# EAGLE design ATEM 2x8GPIOv1.1 (EAGLE 6.2)
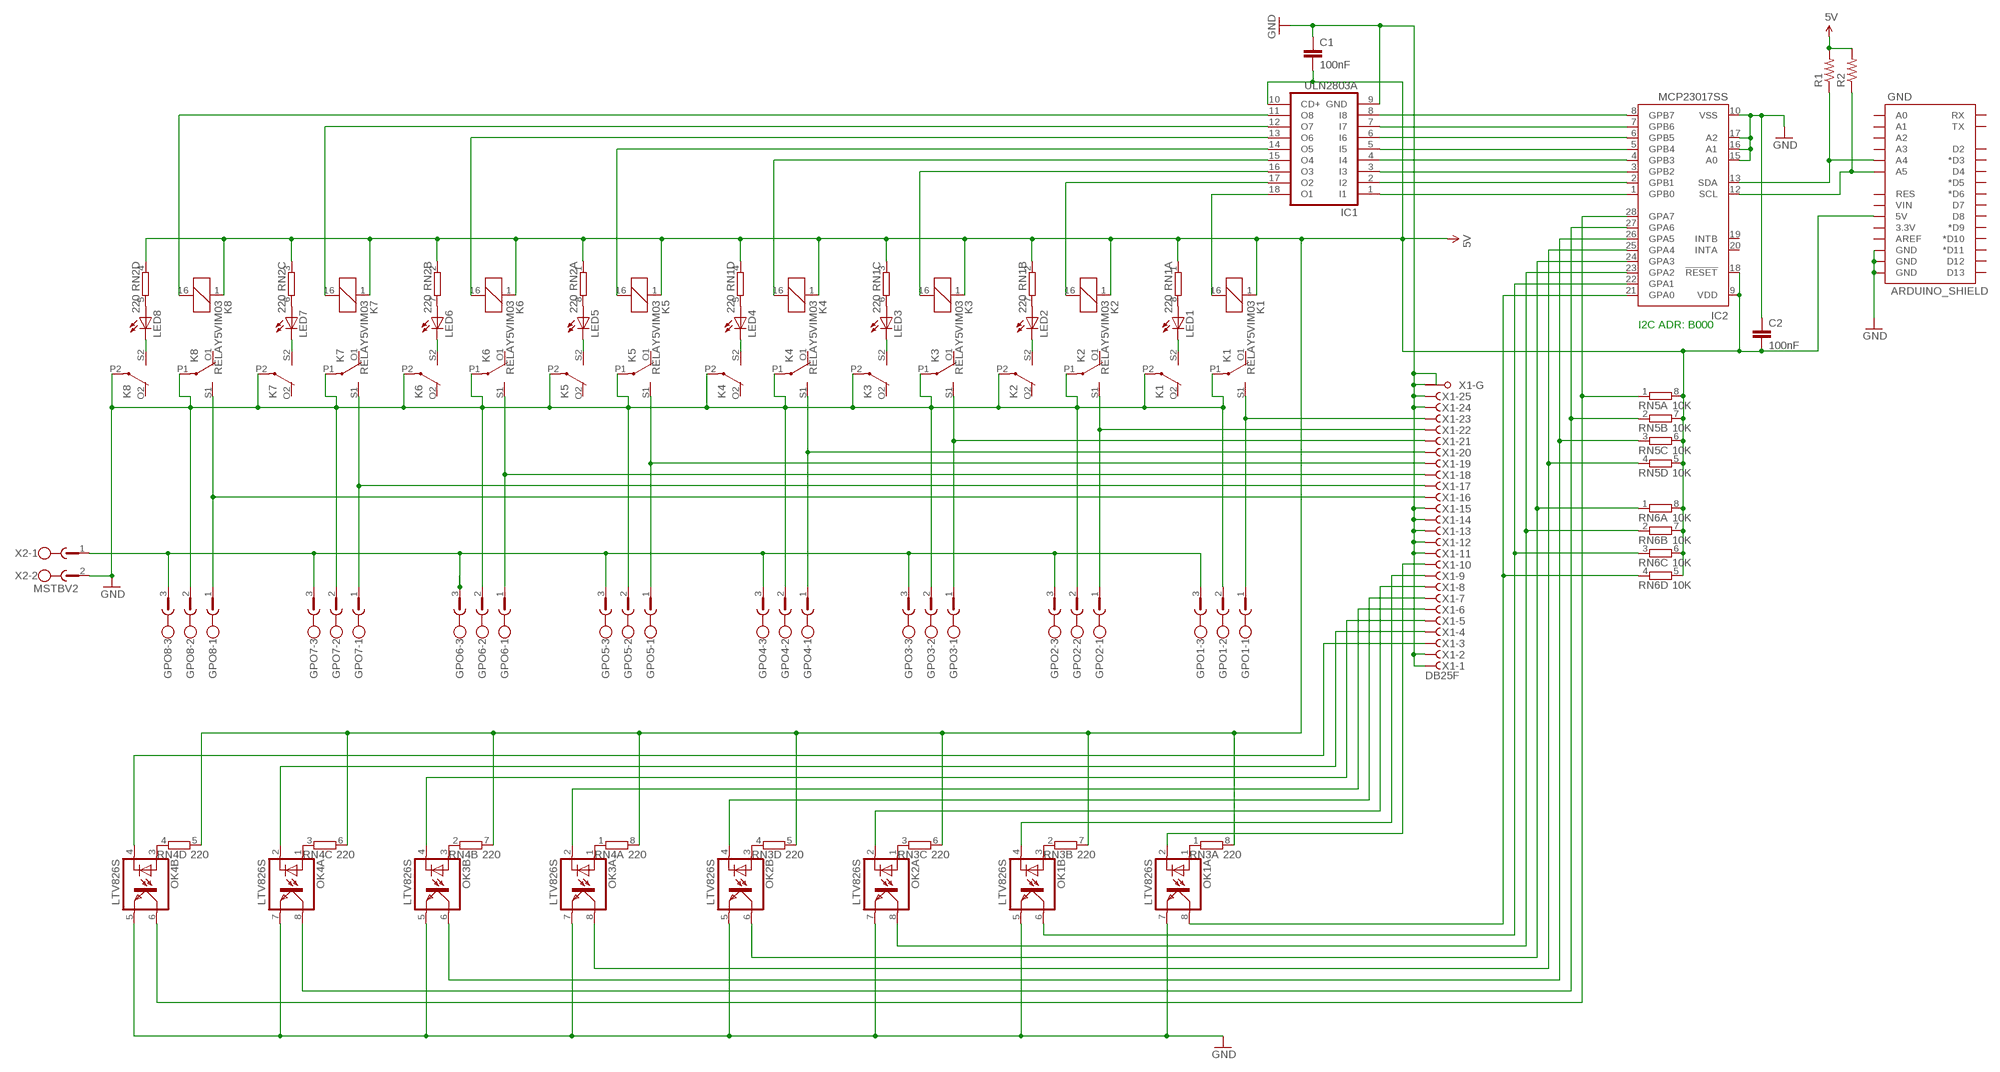
[diagram p0: schematic, sheet 1]

## Parts
C1  100nF  CAP0805  [0805]
C2  100nF  CAP0603-CAP  [0603-CAP]
GND  ARDUINO_SHIELD  [ARDUINO_BOXSHIELD_NOHOLES]
GPO1  CON1  MSTBV3  [MSTBV3]
GPO2  CON1  MSTBV3  [MSTBV3]
GPO3  CON1  MSTBV3  [MSTBV3]
GPO4  CON1  MSTBV3  [MSTBV3]
GPO5  CON1  MSTBV3  [MSTBV3]
GPO6  CON1  MSTBV3  [MSTBV3]
GPO7  CON1  MSTBV3  [MSTBV3]
GPO8  GPO8  MSTBV3  [MSTBV3]
IC1  ULN2803A  ULN2803ASO18W  [SO18W]
IC2  MCP23017SS  [SSOP28]
K1  RELAY5VIM03  [DS2Y]
K2  RELAY5VIM03  [DS2Y]
K3  RELAY5VIM03  [DS2Y]
K4  RELAY5VIM03  [DS2Y]
K5  RELAY5VIM03  [DS2Y]
K6  RELAY5VIM03  [DS2Y]
K7  RELAY5VIM03  [DS2Y]
K8  RELAY5VIM03  [DS2Y]
LED1  LED0603  [LED-0603]
LED2  LED0603  [LED-0603]
LED3  LED0603  [LED-0603]
LED4  LED0603  [LED-0603]
LED5  LED0603  [LED-0603]
LED6  LED0603  [LED-0603]
LED7  LED0603  [LED-0603]
LED8  LED0603  [LED-0603]
OK1  LTV826S  [DIL8-SMD]
OK2  LTV826S  [DIL8-SMD]
OK3  LTV826S  [DIL8-SMD]
OK4  LTV826S  [DIL8-SMD]
R1  RESISTOR0603-RES  [0603-RES]
R2  RESISTOR0603-RES  [0603-RES]
RN1  220  4R-NCAY16  [CAY16]
RN2  220  4R-NCAY16  [CAY16]
RN3  220  4R-NCAY16  [CAY16]
RN4  220  4R-NCAY16  [CAY16]
RN5  10K  4R-NCAY16  [CAY16]
RN6  10K  4R-NCAY16  [CAY16]
X1  DB25F  F25HPS  [F25HP]
X2  MSTBV2  [MSTBV2]

## Nets
5V [PWR]: C1.2 C2.2 GND.5V@0(5V) IC1.10(CD+) IC2.9(VDD) IC2.18(!RESET) K1.1 K2.1 K3.1 K4.1 K5.1 K6.1 K7.1 K8.1 R1.2 R2.2 RN1.1 RN1.2 RN1.3 RN1.4 RN2.1 RN2.2 RN2.3 RN2.4 RN3.5 RN3.6 RN3.7 RN3.8 RN4.5 RN4.6 RN4.7 RN4.8 RN5.5 RN5.6 RN5.7 RN5.8 RN6.5 RN6.6 RN6.7 RN6.8
GND [PWR]: C1.1 C2.1 GND.GND@0(GND) GND.GND@1(GND) GND.GND@4(GND) GPO1.2 GPO2.2 GPO3.2 GPO4.2 GPO5.2 GPO6.2 GPO7.2 GPO8.2 IC1.9(GND) IC2.10(VSS) IC2.15(A0) IC2.16(A1) IC2.17(A2) K1.P1(2:P) K1.P2(3:P) K2.P1(2:P) K2.P2(3:P) K3.P1(2:P) K3.P2(3:P) K4.P1(2:P) K4.P2(3:P) K5.P1(2:P) K5.P2(3:P) K6.P1(2:P) K6.P2(3:P) K7.P1(2:P) K7.P2(3:P) K8.P1(2:P) K8.P2(3:P) OK1.5(B:EMIT) OK1.7(A:EMIT) OK2.5(B:EMIT) OK2.7(A:EMIT) OK3.5(B:EMIT) OK3.7(A:EMIT) OK4.5(B:EMIT) OK4.7(A:EMIT) X1.1(-1:F) X1.2(-2:F) X1.11(-11:F) X1.12(-12:F) X1.13(-13:F) X1.14(-14:F) X1.15(-15:F) X1.24(-24:F) X1.25(-25:F) X1.G1(-G:G1) X1.G2(-G:G2) X2.2
N$1 [RELAY LINES]: GPO1.1 K1.S1(2:S) X1.23(-23:F)
N$3: K1.S2(3:S) LED1.C
N$4: IC1.18(O1) K1.16
N$5: IC1.1(I1) IC2.1(GPB0)
N$6 [RELAY LINES]: GPO2.1 K2.S1(2:S) X1.22(-22:F)
N$8: K2.S2(3:S) LED2.C
N$9: IC1.17(O2) K2.16
N$10 [RELAY LINES]: GPO3.1 K3.S1(2:S) X1.21(-21:F)
N$12: K3.S2(3:S) LED3.C
N$13: IC1.16(O3) K3.16
N$14 [RELAY LINES]: GPO4.1 K4.S1(2:S) X1.20(-20:F)
N$16: K4.S2(3:S) LED4.C
N$17: IC1.15(O4) K4.16
N$18 [RELAY LINES]: GPO5.1 K5.S1(2:S) X1.19(-19:F)
N$20: K5.S2(3:S) LED5.C
N$21: IC1.14(O5) K5.16
N$22 [RELAY LINES]: GPO6.1 K6.S1(2:S) X1.18(-18:F)
N$24: K6.S2(3:S) LED6.C
N$25: IC1.13(O6) K6.16
N$26 [RELAY LINES]: GPO7.1 K7.S1(2:S) X1.17(-17:F)
N$28: K7.S2(3:S) LED7.C
N$29: IC1.12(O7) K7.16
N$30 [RELAY LINES]: GPO8.1 K8.S1(2:S) X1.16(-16:F)
N$32: K8.S2(3:S) LED8.C
N$33: IC1.11(O8) K8.16
N$34: IC1.2(I2) IC2.2(GPB1)
N$35: IC1.3(I3) IC2.3(GPB2)
N$36: IC1.4(I4) IC2.4(GPB3)
N$37: IC1.5(I5) IC2.5(GPB4)
N$38: IC1.6(I6) IC2.6(GPB5)
N$39: IC1.7(I7) IC2.7(GPB6)
N$40: IC1.8(I8) IC2.8(GPB7)
N$41: LED1.A RN1.8
N$42: LED2.A RN1.7
N$43: LED3.A RN1.6
N$44: LED4.A RN1.5
N$45: LED5.A RN2.8
N$46: LED6.A RN2.7
N$47: LED7.A RN2.6
N$48: LED8.A RN2.5
N$49 [INput lines]: OK1.2(A:C) X1.10(-10:F)
N$50: OK1.1(A:A) RN3.1
N$51: IC2.21(GPA0) OK1.8(A:COL) RN6.4
N$52: OK1.3(B:A) RN3.2
N$53: OK2.1(A:A) RN3.3
N$54: OK2.3(B:A) RN3.4
N$55 [INput lines]: OK3.2(A:C) X1.6(-6:F)
N$56: OK3.1(A:A) RN4.1
N$57: OK3.3(B:A) RN4.2
N$58: OK4.1(A:A) RN4.3
N$59: OK4.3(B:A) RN4.4
N$60 [INput lines]: OK1.4(B:C) X1.9(-9:F)
N$61 [INput lines]: OK2.2(A:C) X1.8(-8:F)
N$62 [INput lines]: OK2.4(B:C) X1.7(-7:F)
N$63: IC2.28(GPA7) OK4.6(B:COL) RN5.1
N$64 [INput lines]: OK3.4(B:C) X1.5(-5:F)
N$65 [INput lines]: OK4.2(A:C) X1.4(-4:F)
N$66 [INput lines]: OK4.4(B:C) X1.3(-3:F)
N$67: GND.A5 IC2.12(SCL) R2.1
N$68: IC2.22(GPA1) OK1.6(B:COL) RN6.3
N$69: IC2.23(GPA2) OK2.8(A:COL) RN6.2
N$70: IC2.24(GPA3) OK2.6(B:COL) RN6.1
N$71: IC2.25(GPA4) OK3.8(A:COL) RN5.4
N$72: IC2.26(GPA5) OK3.6(B:COL) RN5.3
N$73: IC2.27(GPA6) OK4.8(A:COL) RN5.2
N$74: GND.A4 IC2.13(SDA) R1.1
N$75 [RELAY LINES]: GPO1.3 GPO2.3 GPO3.3 GPO4.3 GPO5.3 GPO6.3 GPO7.3 GPO8.3 X2.1
Unconnected: GND.0(RX) GND.1(TX) GND.2(D2) GND.3(*D3) GND.3.3V GND.4(D4) GND.5(*D5) GND.6(*D6) GND.7(D7) GND.8(D8) GND.9(*D9) GND.10(*D10) GND.11(*D11) GND.12(D12) GND.13(D13) GND.A0 GND.A1 GND.A2 GND.A3 GND.AREF GND.RESET(RES) GND.VIN IC2.19(INTB) IC2.20(INTA) K1.O1(2:O) K1.O2(3:O) K2.O1(2:O) K2.O2(3:O) K3.O1(2:O) K3.O2(3:O) K4.O1(2:O) K4.O2(3:O) K5.O1(2:O) K5.O2(3:O) K6.O1(2:O) K6.O2(3:O) K7.O1(2:O) K7.O2(3:O) K8.O1(2:O) K8.O2(3:O)

## Notes on the sheet
- I2C ADR: B000

## Library data of the parts
C1 C2 = SparkFun:CAP: Capacitor Standard 0603 ceramic capacitor, and 0.1" leaded capacitor.
GND = SKAARHOJ:ARDUINO_SHIELD
GPO1-GPO8 = con-phoenix-508:MSTBV3: PHOENIX; MPN: MSTBV 2,5/3-GF-5.08; OC_FARNELL: 1792793; OC_NEWARK: 69R9846
IC1 = uln-udn:ULN2803A: DRIVER ARRAY
IC2 = microchip:MCP23017: http://ww1.microchip.com/downloads/en/DeviceDoc/21952a.pdf Source: http://ww1.microchip.com/downloads/en/DeviceDoc/21952a.pdf; MF: MICROCHIP; MPN: MCP23017-E/SS; OC_FARNELL: 1467674; OC_NEWARK: 31K2960
K1-K8 = SKAARHOJ:RELAY5V: RELAY 2 x switch, AxiCom 150 mW 5V
LED1-LED8 = SparkFun:LED: LEDs Standard schematic elements and footprints for 5mm, 3mm, 1206, and 0603 sized LEDs. 5mm - Spark Fun Electronics SKU : COM-00529 (and others)
OK1-OK4 = optocoupler:LTV826: OPTO COUPLER Source: LITEON, LTV816.pdf; OC_FARNELL: unknown; OC_NEWARK: unknown
R1 R2 = SparkFun:RESISTOR: Resistor Basic schematic elements and footprints for 0603, 1206, and PTH resistors.
RN1-RN6 = resistor-dil:4R-N: Array Chip Resistor Source: RS Component / Phycomp; OC_FARNELL: unknown; OC_NEWARK: unknown
X1 = con-subd:F25HPS: SUB-D; OC_FARNELL: unknown; OC_NEWARK: unknown
X2 = con-phoenix-508:MSTBV2: PHOENIX; MPN: MSTBV 2,5/2-GF-5.08; OC_FARNELL: 1792792; OC_NEWARK: 69R9845

## Net classes
1 PWR: width 0.305 mm, clearance 0.152 mm
2 RELAY LINES: width 0.305 mm, clearance 0.254 mm
3 INput lines: clearance 0.254 mm

## Board
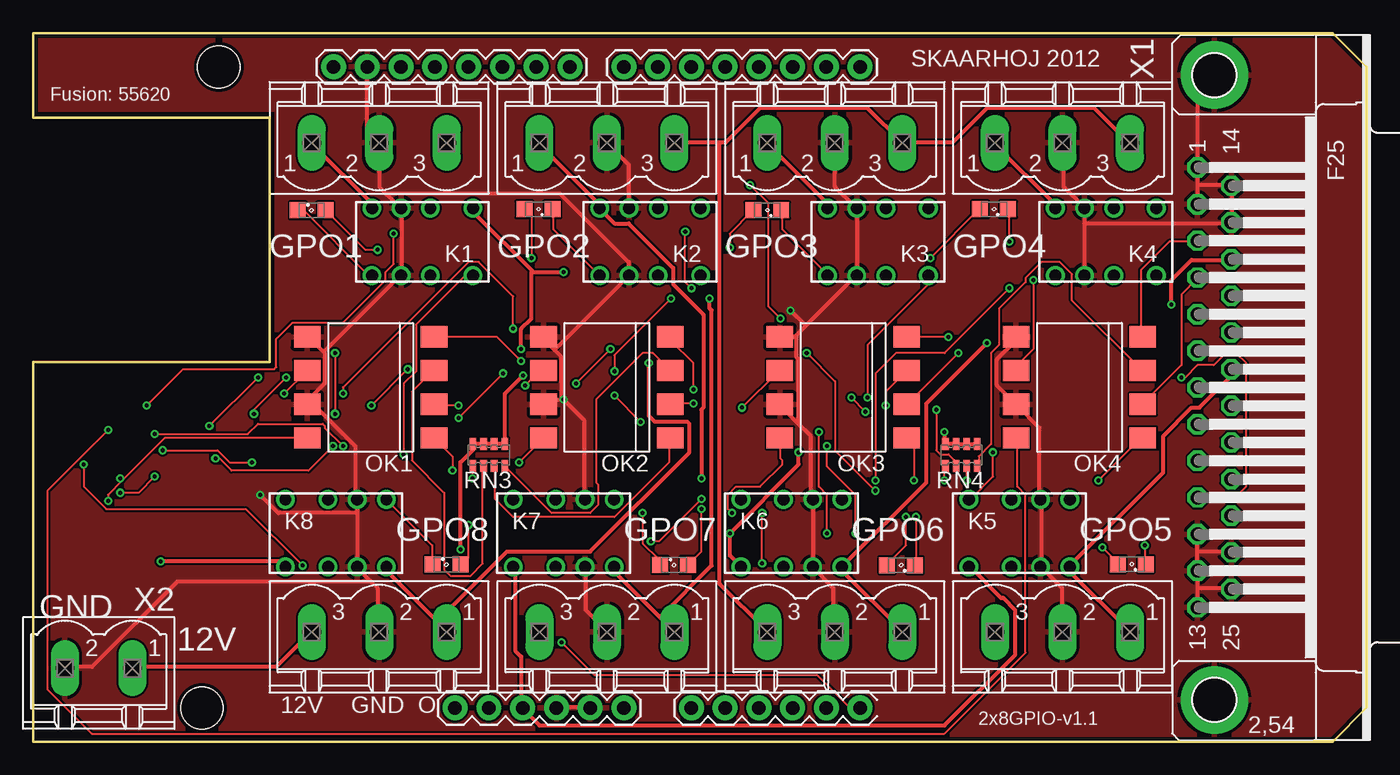
[diagram p1: board, top side]
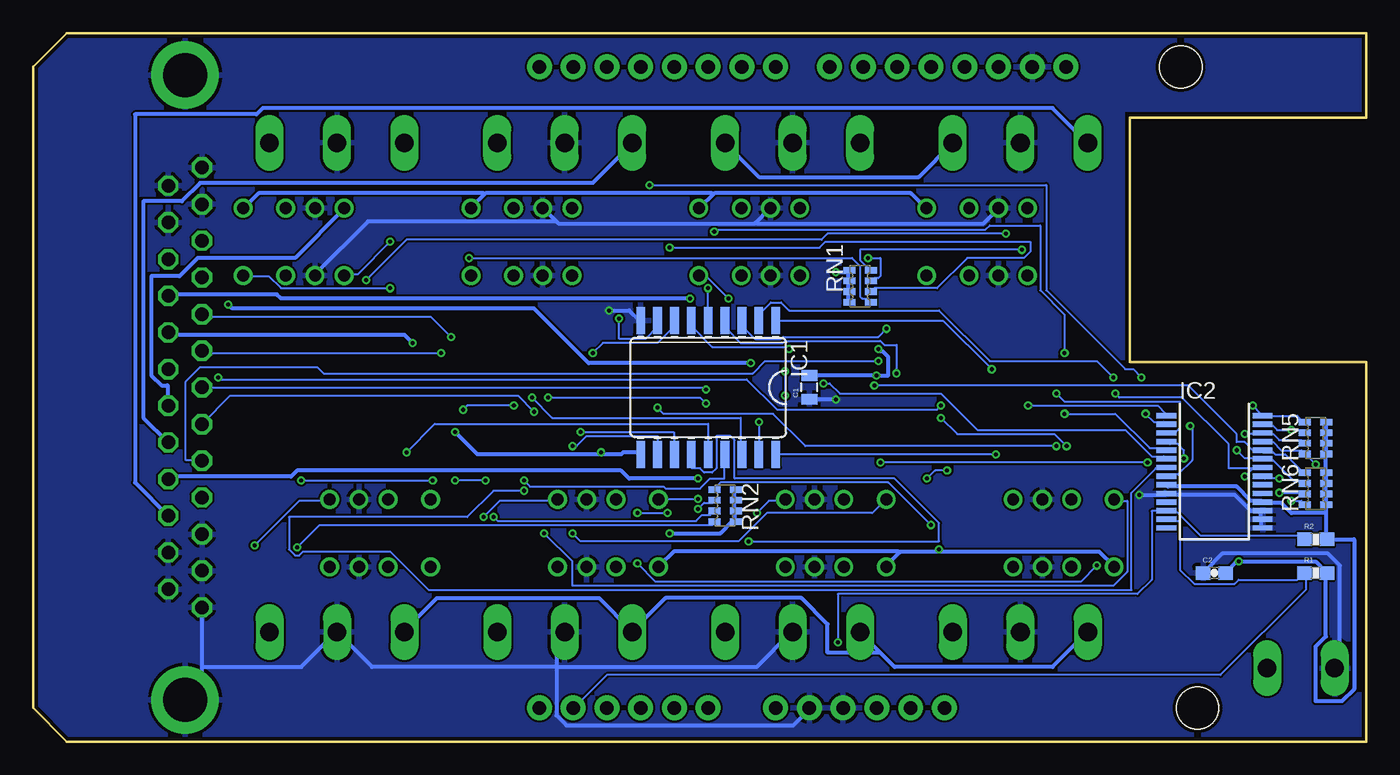
[diagram p2: board, bottom side, seen from below]

Size 100.33 x 53.34 mm. Coordinates in mm from the lower left corner, seen from the top.
Copper layers (1*16): Top 0.035mm / dielectric 1.5mm / Bottom 0.035mm
Design rules: minimum track width 6mil, minimum drill 12mil, track to track 6mil, track to pad 6mil, pad to pad 6mil, via to via 6mil, smd to smd 0mil, copper to edge 10mil, drill to drill 10mil, minimum pad ring 10mil, minimum via ring 6mil, stop-mask expansion 2mil, vias tented up to drill 100mil, thermal gap 10mil

### Footprints (pad centres in the part's own frame; a part is rotated, then mirrored left to right if it is on the bottom)
0805 = smd 0.8 x 1.2: 1 -0.9,0; 2 0.9,0
0603-CAP = smd 1.1 x 1: 1 -0.85,0; 2 0.85,0
ARDUINO_BOXSHIELD_NOHOLES = drill 1.016 pad 1.88: 0 62.23,50.8; 1 59.69,50.8; 2 57.15,50.8; 3 54.61,50.8; 3.3V 34.29,2.54; 4 52.07,50.8; 5 49.53,50.8; 5V@0 36.83,2.54; 6 46.99,50.8; 7 44.45,50.8; 8 40.386,50.8; 9 37.846,50.8; 10 35.306,50.8; 11 32.766,50.8; 12 30.226,50.8; 13 27.686,50.8; A0 49.53,2.54; A1 52.07,2.54; A2 54.61,2.54; A3 57.15,2.54; A4 59.69,2.54; A5 62.23,2.54; AREF 22.606,50.8; GND@0 39.37,2.54; GND@1 41.91,2.54; GND@4 25.146,50.8; RESET 31.75,2.54; VIN 44.45,2.54 | hole 3.2: 13.97,50.8; 12.7,2.54
MSTBV3 = drill 1.397 long: 1 -5.08,0; 2 0,0; 3 5.08,0
SO18W = smd 0.66 x 2.032: 1 -5.08,-5.029; 2 -3.81,-5.029; 3 -2.54,-5.029; 4 -1.27,-5.029; 5 0,-5.029; 6 1.27,-5.029; 7 2.54,-5.029; 8 3.81,-5.029; 9 5.08,-5.029; 10 5.08,5.029; 11 3.81,5.029; 12 2.54,5.029; 13 1.27,5.029; 14 0,5.029; 15 -1.27,5.029; 16 -2.54,5.029; 17 -3.81,5.029; 18 -5.08,5.029
SSOP28 = smd 0.4 x 1.5: 1 -4.225,-3.625; 2 -3.575,-3.625; 3 -2.925,-3.625; 4 -2.275,-3.625; 5 -1.625,-3.625; 6 -0.975,-3.625; 7 -0.325,-3.625; 8 0.325,-3.625; 9 0.975,-3.625; 10 1.625,-3.625; 11 2.275,-3.625; 12 2.925,-3.625; 13 3.575,-3.625; 14 4.225,-3.625; 15 4.225,3.625; 16 3.575,3.625; 17 2.925,3.625; 18 2.275,3.625; 19 1.625,3.625; 20 0.975,3.625; 21 0.325,3.625; 22 -0.325,3.625; 23 -0.975,3.625; 24 -1.625,3.625; 25 -2.275,3.625; 26 -2.925,3.625; 27 -3.575,3.625; 28 -4.225,3.625
DS2Y = drill 0.9: 1 1.2,0.46; 16 1.2,5.54; O1 4.4,0.46; O2 4.4,5.54; P1 6.6,0.46; P2 6.6,5.54; S1 8.8,0.46; S2 8.8,5.54
SML0805 = smd 1.2 x 1.2: A 1.05,0; C -1.05,0
DIL8-SMD = smd 1.6 x 2: 1 -3.81,-4.77; 2 -1.27,-4.77; 3 1.27,-4.77; 4 3.81,-4.77; 5 3.81,4.77; 6 1.27,4.77; 7 -1.27,4.77; 8 -3.81,4.77
0603-RES = smd 1.1 x 1: 1 -0.85,0; 2 0.85,0
CAY16_HAND = smd 0.5 x 0.904: 1 -1.2,-0.813; 2 -0.4,-0.813; 3 0.4,-0.813; 4 1.2,-0.813; 5 1.2,0.813; 6 0.4,0.813; 7 -0.4,0.813; 8 -1.2,0.813
F25HP = drill 1.016 octagon: 1 -16.561,-1.27; 2 -13.792,-1.27; 3 -11.049,-1.27; 4 -8.28,-1.27; 5 -5.512,-1.27; 6 -2.769,-1.27; 7 0,-1.27; 8 2.769,-1.27; 9 5.512,-1.27; 10 8.28,-1.27; 11 11.049,-1.27; 12 13.792,-1.27; 13 16.561,-1.27; 14 -15.189,1.27; 15 -12.421,1.27; 16 -9.652,1.27; 17 -6.909,1.27; 18 -4.14,1.27; 19 -1.372,1.27; 20 1.372,1.27; 21 4.14,1.27; 22 6.909,1.27; 23 9.652,1.27; 24 12.421,1.27; 25 15.189,1.27 | drill 3.302 pad 5.08: G1 -23.52,0; G2 23.52,0
MSTBV2 = drill 1.397 long: 1 -2.54,0; 2 2.54,0

### Placement (x,y rotation side)
C1  41.91,26.67 90 bottom
C2  11.43,12.7 0 bottom
GND  0,0 0 top
GPO1  26.04,45.09 0 top
GPO2  43.18,45.09 0 top
GPO3  60.33,45.09 0 top
GPO4  77.47,45.09 0 top
GPO5  77.47,8.26 180 top
GPO6  60.33,8.26 180 top
GPO7  43.18,8.26 180 top
GPO8  26.04,8.26 180 top
IC1  49.53,26.67 180 bottom
IC2  11.43,20.32 270 bottom
K1  34.29,40.64 180 top
K2  51.44,40.64 180 top
K3  68.58,40.64 180 top
K4  85.72,40.64 180 top
K5  69.22,12.7 0 top
K6  52.07,12.7 0 top
K7  34.92,12.7 0 top
K8  17.78,12.7 0 top
LED1  [SML0805]  20.95,40.01 0 top
LED2  [SML0805]  38.02,40.08 180 top
LED3  [SML0805]  55.24,40.01 180 top
LED4  [SML0805]  72.31,40.08 180 top
LED5  [SML0805]  82.68,13.36 180 top
LED6  [SML0805]  65.3,13.28 180 top
LED7  [SML0805]  48.23,13.31 0 top
LED8  [SML0805]  31.11,13.34 0 top
OK1  25.4,26.67 90 top
OK2  43.18,26.67 90 top
OK3  60.96,26.67 90 top
OK4  78.74,26.67 90 top
R1  3.81,12.7 0 bottom
R2  3.81,15.24 0 bottom
RN1  220  [CAY16_HAND]  38.1,34.29 270 bottom
RN2  220  [CAY16_HAND]  48.26,17.78 90 bottom
RN3  220  [CAY16_HAND]  34.29,21.59 0 top
RN4  220  [CAY16_HAND]  69.85,21.59 0 top
RN5  10K  [CAY16_HAND]  3.81,22.86 270 bottom
RN6  10K  [CAY16_HAND]  3.81,19.05 270 bottom
X1  88.9,26.67 270 top
X2  4.93,5.54 180 top

### Tracks (layer width: path | path; a pad name or v marks a point on that pad's centre or on a via)
5V  (via drill 0.3)
  Top 0.305: v39.93,35.36 37.64,35.36 37.57,35.43 | 37.57,35.43 33.22,39.78 33.22,40.08 K1.1 | K5.1 70.56,13.11 72.85,10.82 73,10.82 73.91,9.91 73.91,6.55 68.58,1.22 38.1,1.22 36.88,2.44 GND.5V@0 36.73,2.59 36.73,6.4 36.27,6.86 36.27,13.11 K7.1 | RN4.5 RN4.6 RN4.7 RN4.8 68.58,22.4 v68.58,23.32 | K6.1 53.19,13.26 52.43,14.02 v52.43,15.7 57.61,20.88 v57.61,21.79 | v36.88,27.58 35.51,26.21 35.51,22.4 RN3.5 RN3.6 RN3.7 RN3.8 33.07,22.4 33.07,21.95 32.16,21.03 v32.16,14.48 | v9.6,13.56 18.59,13.56 18.9,13.26 K8.1 | v36.73,29.57 36.73,31.09 37.49,31.85 37.49,35.36 37.57,35.43
  Bottom 0.305: RN1.4 39.01,33.22 39.01,33.83 RN1.3 39.01,33.98 39.01,34.59 RN1.2 39.01,34.75 39.01,35.36 RN1.1 39.17,35.36 v39.93,35.36 | 49.15,41.22 49.07,41.3 34.29,41.3 33.22,40.23 K1.1 | 49.15,41.22 50.14,40.23 K2.1 | 66.37,41.22 66.29,41.3 49.23,41.3 49.15,41.22 | 66.37,41.22 67.36,40.23 K3.1 | K4.1 84.43,40.23 83.36,41.3 66.45,41.3 66.37,41.22 | C2.2 10.52,12.8 9.75,13.56 v9.6,13.56 3.81,13.56 3.05,12.8 R1.2 3.05,12.65 3.05,7.92 3.81,7.16 3.81,3.05 1.83,3.05 0.91,3.96 0.91,15.24 R2.2 3.05,15.24 3.05,17.22 | RN5.8 3.05,23.93 3.05,23.32 RN5.7 3.05,23.16 3.05,22.55 RN5.6 3.05,22.4 3.05,21.79 RN5.5 3.05,21.64 3.05,20.27 RN6.8 3.05,20.12 3.05,19.51 RN6.7 3.05,19.36 3.05,18.75 RN6.6 3.05,18.59 3.05,17.98 RN6.5 3.05,17.83 3.05,17.22 | 3.05,17.22 5.64,17.22 6.4,17.98 7.77,17.98 IC2.18 7.92,18.14 8.69,18.14 9.75,19.2 14.94,19.2 IC2.9 | v68.58,23.32 66.9,21.64 57.61,21.64 | 57.61,21.64 56.08,21.64 55.93,21.79 54.86,21.79 54.71,21.64 IC1.10 | RN2.4 47.55,18.9 47.55,18.29 RN2.3 47.55,18.14 47.55,17.53 RN2.2 47.55,17.37 47.55,16.61 RN2.1 47.7,16.61 48.62,15.7 v52.43,15.7 | C1.2 41.91,27.58 v36.88,27.58 35.97,27.58 35.97,28.96 36.42,29.41 36.58,29.41 v36.73,29.57 | 32.16,14.33 35.05,14.33 35.13,14.25 | 32.16,14.33 20.12,14.33 19.05,13.26 K8.1 | 35.13,14.25 36.12,13.26 K7.1 | 32.16,14.33 v32.16,14.48 | K6.1 53.19,13.26 52.12,14.33 35.2,14.33 35.13,14.25 | v57.61,21.79 57.61,21.64
GND  (via drill 0.3)
  Top 0.305: 24.38,17.22 24.38,18.14 K8.P2 24.23,18.29 24.23,22.25 20.73,25.76 | 24.38,17.22 24.38,13.26 K8.P1 24.38,13.11 25.38,12.12 | 25.38,12.12 25.91,11.58 25.91,8.38 GPO8.2 | v17.07,18.59 18.44,17.22 24.38,17.22 | X2.2 2.44,5.64 4.42,5.64 10.82,12.04 25.3,12.04 25.38,12.12 | 39.78,25.76 38.86,25.76 38.56,25.45 OK2.7 | 39.24,29.49 39.78,28.96 39.78,25.76 | 39.24,29.49 38.56,30.18 38.56,30.48 OK2.5 | 39.78,25.76 v39.93,25.76 41.45,24.23 41.45,18.29 K7.P2 | 39.24,29.49 44.81,35.05 K2.P2 44.81,35.2 44.81,36.12 39.62,41.3 26.67,41.3 26.59,41.22 | GND.GND@4 25.15,45.87 25.91,45.11 GPO1.2 26.06,44.96 26.06,41.76 26.59,41.22 | 20.73,25.76 20.73,25.45 OK1.7 20.73,25.76 | 20.73,25.76 21.95,26.98 21.95,29.26 21.87,29.34 | 21.87,29.34 20.73,30.48 OK1.5 | 21.87,29.34 27.58,35.05 K1.P2 27.74,35.2 27.74,40.08 K1.P1 27.58,40.23 26.59,41.22 | OK4.5 73.91,30.48 73.91,30.18 72.54,28.8 72.54,26.82 73.91,25.45 OK4.7 74.07,25.3 75.74,23.62 75.74,18.29 K5.P2 75.89,18.14 75.89,13.26 K5.P1 75.89,13.11 77.42,11.58 77.42,8.38 GPO5.2 | 87.63,11.58 X1.12 87.63,14.33 | 87.63,11.58 X1.13 | 87.63,14.33 X1.11 | 87.63,11.58 90.07,11.58 X1.25 | 87.63,14.33 90.07,14.33 X1.24 | 79.1,39.01 79.1,40.08 K4.P1 79.1,40.23 77.57,41.76 77.57,44.96 GPO4.2 | 79.1,39.01 79.1,35.2 K4.P2 | 87.63,41.91 X1.1 87.63,48.92 X1.G1 | 87.63,41.91 X1.2 | 87.63,41.91 90.07,41.91 X1.14 90.22,41.76 90.22,39.17 X1.15 90.07,39.01 79.1,39.01 | K2.P1 44.81,40.23 44.81,43.43 43.28,44.96 GPO2.2 | OK3.5 57.3,30.48 57.38,30.56 | 58.14,31.32 61.87,35.05 K3.P2 62.03,35.2 62.03,40.08 K3.P1 61.87,40.23 60.35,41.76 60.35,44.96 GPO3.2 | 58.14,31.32 57.38,30.56
  Top 0.305: 58.14,31.32 v57,32.46 | K7.P1 41.6,13.11 41.6,9.91 43.13,8.38 GPO7.2 | GND.GND@0 39.47,2.59 41.91,2.59 GND.GND@1 | 57.53,24 58.52,23.01 58.52,18.29 K6.P2 58.67,18.14 58.67,13.26 K6.P1 58.67,13.11 60.2,11.58 60.2,8.38 GPO6.2 | 57.53,24 56.24,25.3 OK3.7 | 57.38,30.56 57.45,30.48 57.45,28.96 57.61,28.8 57.61,24.08 57.53,24
  Bottom 0.305: C2.1 12.19,12.8 10.82,14.17 2.9,14.17 1.98,13.26 1.98,5.64 2.29,5.64 X2.2 | IC2.15 7.92,16.15 7.92,16.61 IC2.16 7.92,16.76 7.92,17.37 IC2.17 8.08,17.37 8.69,17.37 9.91,18.59 14.94,18.59 IC2.10 15.09,18.59 v17.07,18.59 | v39.93,25.76 41.91,25.76 C1.1 | 87.63,5.64 87.63,3.2 88.85,3.2 X1.G2 | 87.63,5.64 X1.13 | 87.63,5.64 80.16,5.64 77.57,8.23 GPO5.2 77.42,8.23 74.83,5.64 60.96,5.64 | v57,32.46 55.47,32.46 54.71,31.7 IC1.9 | 45.95,39.09 46.02,39.01 60.81,39.01 61.04,39.24 | 45.95,39.09 44.96,40.08 K2.P1 | 61.04,39.24 61.87,40.08 K3.P1 | 60.96,5.64 60.96,8.23 60.35,8.23 GPO6.2 | 60.96,5.64 60.96,1.98 60.2,1.22 43.13,1.22 41.91,2.44 GND.GND@1 | 60.96,5.64 45.87,5.64 43.28,8.23 GPO7.2 | K4.P2 79.1,35.2 75.13,39.17 61.11,39.17 61.04,39.24 | K1.P1 27.74,40.08 28.8,39.01 45.87,39.01 45.95,39.09
  pour Bottom: 0,0 0,53.34 100.33,53.34 100.33,0
  pour Top: 0,0 0,53.34 100.33,53.34 100.33,0
N$1
  Top 0.305: K1.S1 25.45,40.23 25.45,40.54 21.03,44.96 GPO1.1
  Bottom 0.305: X1.23 92.66,19.51 92.66,47.24 83.52,47.24 83.06,47.7 23.62,47.7 21.03,45.11 GPO1.1
N$3
  Top 0.152: LED1.C 19.96,39.93 20.42,39.93 25.15,35.2 25.45,35.2 K1.S2
N$4  (via drill 0.3)
  Top 0.152: v27.89,21.64 27.89,26.98 28.8,27.89 28.8,31.39 32.46,35.05 33.07,35.05 K1.16
  Bottom 0.152: v27.89,21.64 IC1.18
N$5  (via drill 0.3)
  Top 0.152: v28.19,28.04 v25.45,25.3
  Bottom 0.152: v25.45,25.3 15.7,25.3 15.09,24.69 IC2.1 | v28.19,28.04 31.85,31.7 IC1.1
N$6  (via drill 0.3)
  Top 0.305: GPO2.1 38.1,44.96 42.52,40.54 42.52,40.23 K2.S1 42.67,40.08 43.74,39.01 44.81,39.01 48.16,35.66 48.16,34.44 50.44,32.16 50.44,25.15 50.29,24.99 v50.29,19.81
  Bottom 0.305: v50.29,19.81 55.47,19.81 56.08,20.42 80.47,20.42 80.92,19.96 89.92,19.96 90.07,19.81 X1.22
N$8
  Top 0.152: LED2.C 39.17,40.08 39.17,38.56 42.52,35.2 K2.S2
N$9  (via drill 0.3)
  Top 0.152: v43.74,26.06 v45.72,24.08 | v43.74,27.89 43.74,29.11 v48.01,33.38
  Bottom 0.152: v45.72,24.08 IC1.17 | v43.74,27.89 v43.74,26.06 | v48.01,33.38 49.68,35.05 50.14,35.05 K2.16
N$10
  Top 0.305: K3.S1 59.74,40.23 59.74,40.54 55.32,44.96 GPO3.1
  Bottom 0.305: X1.21 90.22,22.55 92.05,24.38 92.05,40.69 89.15,40.69 87.78,42.06 58.22,42.06 55.32,44.96 GPO3.1
N$12
  Top 0.152: LED3.C 56.39,39.93 56.39,38.56 59.74,35.2 K3.S2
N$13  (via drill 0.3)
  Top 0.152: v62.79,25.91 62.79,29.87 67.36,34.44 67.36,35.05 K3.16
  Bottom 0.152: v62.79,25.91 61.27,24.38 47.09,24.38 47.09,21.64 IC1.16
N$14
  Top 0.305: K4.S1 76.81,40.23 76.81,40.54 72.39,44.96 GPO4.1
  Bottom 0.305: X1.20 90.22,25.3 90.22,26.82 90.68,26.82 91.44,27.58 91.44,35.05 89.31,35.05 87.94,36.42 80.62,36.42 76.96,40.08 K4.S1
N$16  (via drill 0.3)
  Top 0.152: v73.46,37.64 73.46,40.08 LED4.C
  Bottom 0.152: v73.46,37.64 75.89,35.2 76.81,35.2 K4.S2
N$17  (via drill 0.3)
  Top 0.152: v63.4,19.66 63.4,27.74 64.92,29.26 68.58,29.26 v73.46,34.14
  Bottom 0.152: v63.4,19.66 62.94,19.2 52.88,19.2 52.73,19.05 50.14,19.05 49.38,19.81 48.31,19.81 48.31,21.64 IC1.15 | v73.46,34.14 81.69,34.14 82.6,35.05 84.43,35.05 K4.16
N$18
  Top 0.305: GPO5.1 82.45,8.38 78.03,12.8 78.03,13.11 K5.S1 78.03,13.26 85.04,20.27 85.04,23.01 87.17,25.15 87.78,25.15 90.07,27.43 90.07,28.04 X1.19
N$20  (via drill 0.3)
  Top 0.152: v83.67,14.78 83.67,13.41 LED5.C
  Bottom 0.152: v83.67,14.78 80.31,18.14 78.03,18.14 K5.S2
N$21  (via drill 0.3)
  Top 0.152: v72.24,21.79 72.24,19.96 70.56,18.29 K5.16
  Bottom 0.152: IC1.14 49.53,23.93 70.1,23.93 v72.24,21.79
N$22  (via drill 0.3)
  Top 0.305: GPO6.1 65.38,8.38 60.96,12.8 60.96,13.11 K6.S1 60.96,13.26 67.21,19.51 67.21,25.45 v71.78,30.02
  Bottom 0.305: v71.78,30.02 72.39,30.63 89.92,30.63 90.07,30.79 X1.18
N$24  (via drill 0.3)
  Top 0.152: v66.45,16.92 66.45,13.41 LED6.C
  Bottom 0.152: v66.45,16.92 65.23,18.14 60.96,18.14 K6.S2
N$25  (via drill 0.3)
  Top 0.152: v46.48,15.09 47.09,15.09 v50.29,18.29
  Bottom 0.152: v46.48,15.09 32.16,15.09 32.16,16.46 35.51,19.81 47.55,19.81 47.55,22.71 47.85,23.01 48.92,23.01 48.92,20.57 49.23,20.27 49.84,20.27 50.14,20.57 50.75,20.57 50.75,21.64 IC1.13 | v50.29,18.29 53.19,18.29 K6.16
N$26  (via drill 0.3)
  Top 0.305: K7.S1 43.74,13.11 43.74,12.8 48.16,8.38 GPO7.1 47.24,9.45 51.05,13.26 51.05,32.46 50.9,32.61 v50.9,33.38
  Bottom 0.305: v50.9,33.38 81.69,33.38 81.99,33.68 90.07,33.68 X1.17
N$28  (via drill 0.3)
  Top 0.152: v45.87,17.22 45.87,14.94 47.09,13.72 47.09,13.41 LED7.C
  Bottom 0.152: v45.87,17.22 44.96,18.14 43.74,18.14 K7.S2
N$29  (via drill 0.3)
  Top 0.152: v59.13,23.32 59.13,19.2 59.74,18.59 v59.74,15.7
  Bottom 0.152: v59.13,23.32 52.12,23.32 52.12,21.64 IC1.12 | v59.74,15.7 59.13,15.09 47.24,15.09 45.11,17.22 37.19,17.22 36.27,18.14 K7.16
N$30  (via drill 0.3)
  Top 0.305: K8.S1 26.67,13.11 26.67,12.8 31.09,8.38 GPO8.1 30.48,9.14 35.66,14.33 41.91,14.33 49.38,21.79 49.38,23.93 49.23,24.08 46.79,24.08 46.33,24.54 v46.33,28.5 | v85.65,32.92 85.65,34.75 87.17,36.27 90.07,36.27 X1.16
  Bottom 0.305: v85.65,32.92 85.34,32.61 62.64,32.61 58.52,28.5 v46.33,28.5
N$32
  Top 0.152: LED8.C 30.02,13.41 30.02,14.78 26.67,18.14 K8.S2
N$33  (via drill 0.3)
  Top 0.152: v59.74,22.25 59.74,20.73 61.87,18.59 v61.87,15.7
  Bottom 0.152: IC1.11 53.34,23.01 58.67,23.01 59.44,22.25 v59.74,22.25 | v61.87,15.7 59.74,13.56 59.74,11.73 19.05,11.73 17.98,12.8 17.98,18.14 18.9,18.14 K8.16
N$34  (via drill 0.3)
  Top 0.152: v16.61,24.69 16.61,24.99 v19.05,27.43
  Bottom 0.152: v16.61,24.69 16,24.08 15.24,24.08 15.09,23.93 IC2.2 | v19.05,27.43 20.27,28.65 28.35,28.65 32.16,32.46 43.43,32.46 44.04,33.07 44.81,33.07 45.72,32.16 IC1.2
N$35  (via drill 0.3)
  Top 0.152: v23.32,26.21 23.32,26.67 32.77,36.12 33.53,36.12 36.12,33.53 v36.12,31.09
  Bottom 0.152: v23.32,26.21 22.71,25.6 14.02,25.6 14.02,23.62 14.33,23.32 14.94,23.32 IC2.3 | v36.12,31.09 36.73,30.48 43.89,30.48 44.04,30.33 46.02,30.33 46.94,31.24 46.94,31.7 IC1.3
N$36  (via drill 0.3)
  Top 0.152: v13.72,21.34 14.02,21.34 14.94,20.42 20.73,20.42 v22.55,22.25 | v35.36,27.74 v32,24.38
  Bottom 0.152: v13.72,21.34 13.72,21.95 14.17,22.4 14.78,22.4 14.94,22.55 IC2.4 | v22.55,22.25 23.47,23.16 30.79,23.16 v32,24.38 | v35.36,27.74 35.36,29.87 36.27,29.87 36.58,30.18 43.74,30.18 43.89,30.02 47.09,30.02 48.16,31.09 48.16,31.7 IC1.4
N$37  (via drill 0.3)
  Top 0.152: v22.71,29.26 v22.71,24.69 | v49.07,38.41 49.07,34.59 v49.53,34.14
  Bottom 0.152: v22.71,24.69 18.9,24.69 16.31,22.1 15.24,22.1 15.09,21.95 IC2.5 | v22.71,29.26 22.71,32.16 24.54,33.98 24.54,38.86 28.35,38.86 28.65,38.56 48.92,38.56 v49.07,38.41 | IC1.5 v49.53,34.14
N$38  (via drill 0.3)
  Top 0.152: v43.43,29.57 v40.84,26.98
  Bottom 0.152: v40.84,26.98 40.39,26.98 39.62,26.21 32,26.21 29.26,23.47 18.14,23.47 16.15,21.49 15.24,21.49 15.09,21.34 IC2.6 | v43.43,29.57 43.59,29.72 49.23,29.72 50.75,31.24 50.75,31.7 IC1.6
N$39  (via drill 0.3)
  Top 0.152: v63.4,18.9 60.35,21.95 60.35,27.13 v58.22,29.26
  Bottom 0.152: v63.4,18.9 65.68,18.9 67.67,16.92 81.08,16.92 81.08,14.48 80.62,14.02 80.31,14.02 80.01,14.33 73.46,14.33 70.56,11.43 17.68,11.43 17.68,18.75 15.85,20.57 15.09,20.57 IC2.7 | v58.22,29.26 57.45,30.02 53.34,30.02 52.12,31.24 52.12,31.7 IC1.7
N$40  (via drill 0.3)
  Top 0.152: v16.92,27.43 v13.26,23.77 | v53.95,41.91 55.32,40.54 55.32,32.77 v56.24,31.85
  Bottom 0.152: v13.26,23.77 13.11,23.77 13.11,21.18 14.17,20.12 14.94,20.12 IC2.8 | v16.92,27.43 17.53,28.04 18.14,28.04 24.08,33.98 24.08,41.91 v53.95,41.91 | v56.24,31.85 56.24,30.33 54.25,30.33 53.34,31.24 IC1.8
N$41  (via drill 0.3)
  Top 0.152: v25.91,37.03 24.99,37.03 22.1,39.93 LED1.A
  Bottom 0.152: v25.91,37.03 38.1,37.03 38.1,36.27 37.34,35.51 RN1.8
N$42  (via drill 0.3)
  Top 0.152: v37.49,36.42 37.49,39.62 37.03,40.08 LED2.A
  Bottom 0.152: v37.49,36.42 36.58,36.42 36.58,35.05 36.73,34.9 37.03,34.9 37.19,34.75 RN1.7
N$43  (via drill 0.3)
  Top 0.152: v52.43,37.19 52.43,38.25 54.1,39.93 LED3.A
  Bottom 0.152: v52.43,37.19 41.15,37.19 40.69,37.64 25.3,37.64 25.3,36.88 25.76,36.42 30.02,36.42 32.31,34.14 37.03,34.14 37.19,33.98 RN1.6
N$44  (via drill 0.3)
  Top 0.152: v67.51,36.42 71.17,40.08 LED4.A
  Bottom 0.152: v67.51,36.42 38.71,36.42 38.1,35.81 38.1,33.53 37.95,33.38 37.49,33.38 37.34,33.22 RN1.5
N$45  (via drill 0.3)
  Top 0.152: v80.47,14.63 81.69,13.41 LED5.A
  Bottom 0.152: v80.47,14.63 78.79,16.31 49.23,16.31 49.07,16.46 RN2.8
N$46  (via drill 0.3)
  Top 0.152: v65.68,16.92 65.68,14.78 64.31,13.41 LED6.A
  Bottom 0.152: v65.68,16.92 65.38,16.61 50.44,16.61 49.99,17.07 49.38,17.07 RN2.7
N$47  (via drill 0.3)
  Top 0.152: v50.29,17.53 50.29,14.33 49.38,13.41 LED7.A
  Bottom 0.152: v50.29,17.53 49.84,17.98 49.23,17.98 49.07,18.14 RN2.6
N$48  (via drill 0.3)
  Top 0.152: v32.77,16.31 32.77,13.87 32.31,13.41 LED8.A
  Bottom 0.152: v32.77,16.31 35.97,19.51 48.62,19.51 49.07,19.05 RN2.5
N$49  (via drill 0.3)
  Top 0.152: v32,25.3 30.18,25.3 OK1.2 | v86.41,27.43 86.72,27.43 87.63,28.35 88.85,28.35 89.76,29.26 90.53,29.26 91.29,28.5 91.29,19.2 90.53,18.44 87.63,18.44 X1.10
  Bottom 0.152: v32,25.3 32.31,24.99 44.35,24.99 46.63,27.28 86.26,27.28 v86.41,27.43
N$50  (via drill 0.3)
  Top 0.152: v33.07,19.81 33.07,20.73 RN3.1 | v31.55,20.42 31.55,21.49 OK1.1
  Bottom 0.152: v33.07,19.81 32.46,20.42 v31.55,20.42
N$51  (via drill 0.3)
  Top 0.152: v5.64,18.14 5.64,18.59 6.71,19.66 | 6.71,19.66 9.91,22.86 OK1.8 | 6.71,19.66 v6.55,19.81
  Bottom 0.152: v5.64,18.14 4.88,18.14 4.72,17.98 RN6.4 | v6.55,19.81 7.62,19.81 7.77,19.96 IC2.21
N$52
  Top 0.152: RN3.2 33.83,20.73 33.83,13.41 32.92,12.5 31.39,12.5 30.94,12.95 30.94,18.75 28.5,21.18 28.5,26.36 30.02,27.89 OK1.3
N$53
  Top 0.152: RN3.3 34.75,20.73 34.75,18.29 36.12,16.92 43.74,16.92 47.85,21.03 47.85,22.86 OK2.1
N$54
  Top 0.152: RN3.4 35.51,20.73 39.01,17.22 41.91,17.22 42.52,17.83 42.52,19.36 42.37,19.51 42.37,25.76 45.87,29.26 46.63,29.26 47.85,28.04 OK2.3
N$55  (via drill 0.3)
  Top 0.152: v69.65,29.26 65.84,25.45 OK3.2
  Bottom 0.152: v69.65,29.26 87.48,29.26 87.63,29.41 X1.6
N$56  (via drill 0.3)
  Top 0.152: v68.58,19.66 68.58,20.73 RN4.1 | v66.29,19.66 66.29,22.4 65.84,22.86 OK3.1
  Bottom 0.152: v66.29,19.66 v68.58,19.66
N$57  (via drill 0.3)
  Top 0.152: v67.97,24.99 67.97,21.95 68.28,21.64 68.89,21.64 69.34,21.18 69.34,20.88 RN4.2 | v64.16,25.3 64.16,26.36 65.68,27.89 OK3.3
  Bottom 0.152: v67.97,24.99 67.67,25.3 v64.16,25.3
N$58  (via drill 0.3)
  Top 0.152: v70.26,19.66 70.26,20.73 RN4.3 | v80.16,19.66 83.36,22.86 OK4.1
  Bottom 0.152: v80.16,19.66 v70.26,19.66
N$59
  Top 0.152: RN4.4 71.17,20.88 71.17,21.49 72.08,22.4 72.08,29.26 72.69,29.87 72.69,32.61 74.68,34.59 74.68,34.9 75.89,36.12 77.27,36.12 78.18,35.2 78.18,33.22 83.36,28.04 OK4.3
N$60  (via drill 0.3)
  Top 0.152: OK1.4 34.9,30.48 v36.73,28.65
  Bottom 0.152: v36.73,28.65 45.26,28.65 46.18,27.74 78.49,27.74 78.94,28.19 87.78,28.19 88.85,27.13 88.85,21.18 87.63,21.18 X1.9
N$61  (via drill 0.3)
  Top 0.152: v49.68,25.45 48.01,25.45 OK2.2 | v62.64,24.84 v61.57,25.91
  Bottom 0.152: v49.68,25.45 50.14,25.91 v61.57,25.91 | v62.64,24.84 63.86,26.06 85.5,26.06 87.63,23.93 X1.8
N$62  (via drill 0.3)
  Top 0.152: v49.68,26.52 49.68,28.5 48.01,30.18 48.01,30.48 OK2.4
  Bottom 0.152: v49.68,26.52 49.84,26.67 X1.7
N$63  (via drill 0.3)
  Top 0.152: v75.29,34.75 75.29,29.57 74.07,28.35 74.07,28.04 OK4.6 | v27.13,38.25 27.13,35.97 26.52,35.36 26.52,34.75 23.32,31.55 19.51,31.55 18.29,30.33 18.29,28.19 18.14,28.04 11.28,28.04 v8.53,25.3
  Bottom 0.152: RN5.1 4.72,24.08 5.18,24.54 7.77,24.54 IC2.28 7.92,24.69 v8.53,25.3 | v75.29,34.75 72.24,37.8 41,37.8 40.54,38.25 v27.13,38.25
N$64  (via drill 0.3)
  Top 0.152: v68.89,30.48 OK3.4
  Bottom 0.152: v68.89,30.48 70.41,32 87.48,32 87.63,32.16 X1.5
N$65
  Top 0.152: OK4.2 83.52,25.45 86.41,28.35 86.41,33.68 87.63,34.9 X1.4
N$66
  Top 0.152: OK4.4 83.36,30.48 83.36,35.51 85.5,37.64 87.63,37.64 X1.3
N$67  (via drill 0.3)
  Top 0.152: v39.78,7.47 42.22,5.03 58.98,5.03 61.42,2.59 62.18,2.59 GND.A5
  Bottom 0.152: R2.1 4.72,15.24 5.03,15.54 12.5,15.54 14.33,17.37 14.94,17.37 IC2.12 15.09,17.37 16.15,17.37 16.15,12.19 17.22,11.12 39.78,11.12 v39.78,7.47
N$68  (via drill 0.3)
  Top 0.152: v6.55,18.75 7.92,18.75 v9.14,19.96 | v18.9,26.21 20.57,27.89 OK1.6
  Bottom 0.152: v6.55,18.75 4.72,18.75 RN6.3 | 8.53,20.57 v9.14,19.96 | 8.53,20.57 7.92,20.57 IC2.22 8.53,20.57 | v18.9,26.21 18.59,25.91 13.87,25.91 10.36,22.4 10.36,20.57 8.53,20.57
N$69  (via drill 0.3)
  Top 0.152: v36.58,21.03 OK2.8 | v16.46,21.03 14.78,21.03 13.87,21.95 v9.75,21.95
  Bottom 0.152: RN6.2 4.72,19.51 4.88,19.66 5.49,19.66 7.01,21.18 7.77,21.18 IC2.23 7.92,21.34 9.14,21.34 v9.75,21.95 | v16.46,21.03 v36.58,21.03
N$70  (via drill 0.3)
  Top 0.152: v37.03,26.82 38.1,27.89 38.41,27.89 OK2.6
  Bottom 0.152: RN6.1 4.72,20.27 6.1,21.64 6.86,21.64 7.01,21.79 7.77,21.79 IC2.24 7.92,21.95 8.53,21.95 9.14,22.55 9.75,22.55 9.75,23.16 13.41,26.82 v37.03,26.82
N$71  (via drill 0.3)
  Top 0.152: v52.58,17.22 52.27,17.53 52.27,18.59 52.88,19.2 54.71,19.2 56.39,20.88 56.39,21.18 56.24,21.34 56.24,22.86 OK3.8 | v54.86,13.41 v54.86,17.22 | v20.27,13.26 16,17.53 5.49,17.53 3.81,19.2 v3.81,20.88
  Bottom 0.152: IC2.25 7.77,22.55 7.01,22.55 6.4,21.95 4.88,21.95 4.72,21.79 RN5.4 4.57,21.64 v3.81,20.88 | v54.86,17.22 v52.58,17.22 | v54.86,13.41 53.49,12.04 21.49,12.04 v20.27,13.26
N$72  (via drill 0.3)
  Top 0.152: v53.34,25.15 56.08,27.89 OK3.6 | v23.32,22.25 21.95,23.62 21.95,23.77 21.79,23.93 16.92,23.93 16.15,23.16 v9.14,23.16
  Bottom 0.152: RN5.3 4.72,22.55 4.88,22.71 6.55,22.71 7.01,23.16 7.77,23.16 IC2.26 7.92,23.16 v9.14,23.16 | v53.34,25.15 52.88,24.69 44.65,24.69 42.22,22.25 v23.32,22.25
N$73  (via drill 0.3)
  Top 0.152: v5.64,23.47 1.07,18.9 1.07,3.96 4.42,0.61 68.58,0.61 74.68,6.71 74.68,18.59 74.07,19.2 74.07,22.86 OK4.8
  Bottom 0.152: RN5.2 4.72,23.32 4.88,23.47 v5.64,23.47 6.71,23.47 7.01,23.77 7.77,23.77 IC2.27
N$74
  Bottom 0.152: IC2.13 14.94,16.61 14.02,16.61 14.02,12.95 12.95,11.89 9.91,11.89 9.6,12.19 5.18,12.19 4.72,12.65 R1.1 4.57,12.65 4.57,11.43 10.97,5.03 57.15,5.03 59.59,2.59 GND.A4
N$75
  Top 0.305: GPO4.3 82.45,45.11 79.86,47.7 71.78,47.7 69.19,45.11 65.53,45.11 GPO3.3 62.79,47.7 54.71,47.7 52.12,45.11 51.66,45.11 | 51.66,45.11 48.31,45.11 GPO2.3 | X2.1 7.47,5.64 18.29,5.64 20.88,8.23 GPO8.3 | 51.66,45.11 51.66,11.89 55.17,8.38 GPO6.3
  Bottom 0.305: GPO1.3 33.68,42.52 45.72,42.52 48.16,44.96 GPO2.3 | GPO5.3 72.39,8.38 69.95,10.82 57.76,10.82 55.32,8.38 GPO6.3 55.17,8.38 52.73,10.82 42.52,10.82 40.54,8.84 40.54,6.71 36.73,6.71 36.65,6.78 | 36.65,6.78 35.51,5.64 23.62,5.64 21.03,8.23 GPO8.3 | 36.65,6.78 38.1,8.23 GPO7.3

### Text on the board
_tsilk: SKAARHOJ 2012 | Fusion: 55620 | GND | 12V | 12V | GND | O | 2x8GPIO-v1.1